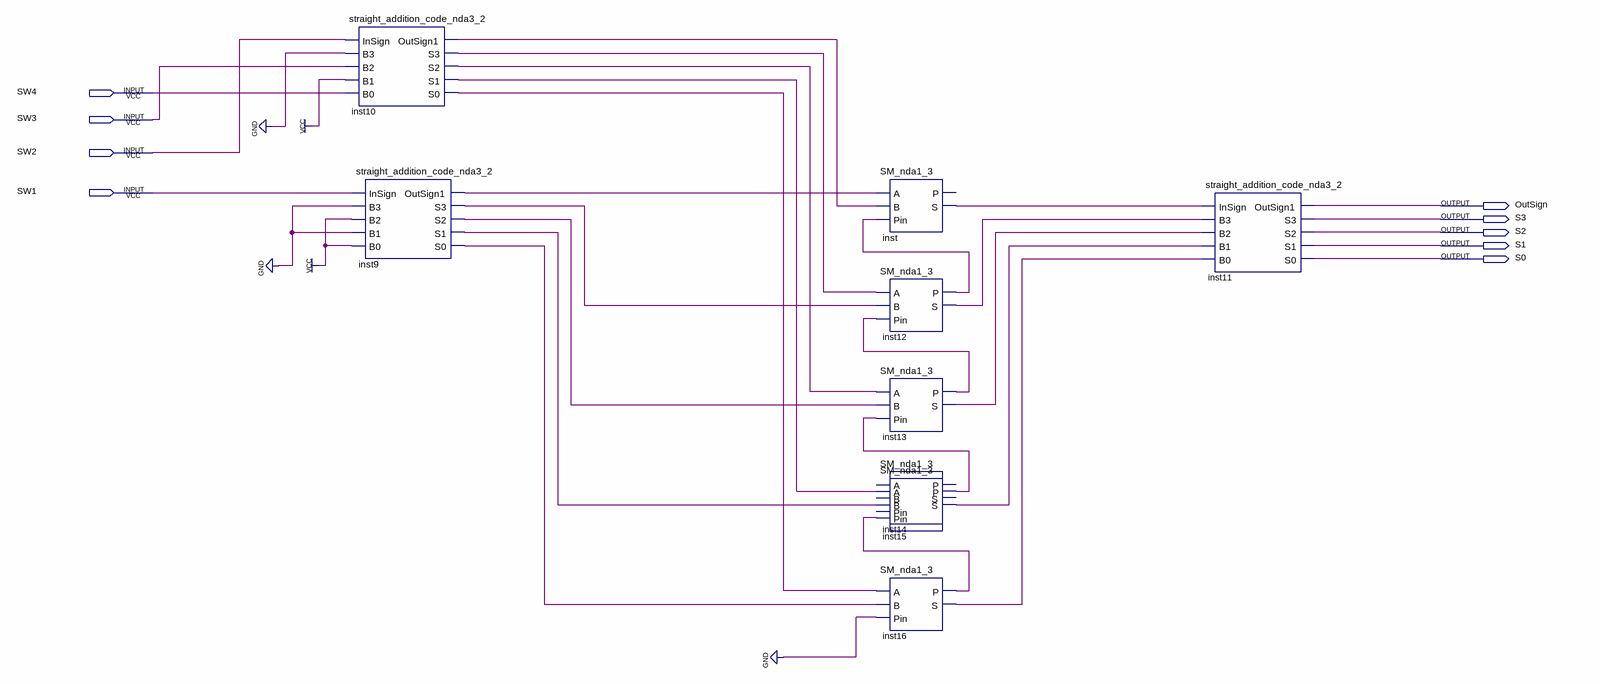
[diagram p0: schematic sheet]
// Quartus schematic ALU_nda1_3.bdf as structural Verilog: 9 symbols, 9 pins
module ALU_nda1_3 (
  input  SW4,
  input  SW3,
  input  SW2,
  input  SW1,
  output OutSign,
  output S3,
  output S2,
  output S1,
  output S0
);

  wire inst9_outsign1, inst9_s0, inst9_s1, inst9_s2, inst9_s3, inst10_outsign1, inst10_s0, inst10_s1,
       inst10_s2, inst10_s3, inst12_p, inst12_s, inst13_p, inst13_s, inst15_p, inst15_s, inst16_p, inst16_s,
       inst_s;

  straight_addition_code_nda3_2 inst10 (
    .InSign(SW2), .B3(1'b0), .B2(SW3), .B1(1'b1), .B0(SW4), .OutSign1(inst10_outsign1), .S3(inst10_s3),
    .S2(inst10_s2), .S1(inst10_s1), .S0(inst10_s0));
  straight_addition_code_nda3_2 inst9 (
    .InSign(SW1), .B3(1'b0), .B2(1'b1), .B1(1'b0), .B0(1'b1), .OutSign1(inst9_outsign1), .S3(inst9_s3),
    .S2(inst9_s2), .S1(inst9_s1), .S0(inst9_s0));
  SM_nda1_3 inst (.A(inst9_outsign1), .B(inst10_outsign1), .Pin(inst12_p), .S(inst_s));  // open: P
  SM_nda1_3 inst12 (.A(inst10_s3), .B(inst9_s3), .Pin(inst13_p), .P(inst12_p), .S(inst12_s));
  SM_nda1_3 inst13 (.A(inst10_s2), .B(inst9_s2), .Pin(inst15_p), .P(inst13_p), .S(inst13_s));
  SM_nda1_3 inst14 ();  // open: A, B, Pin, P, S
  SM_nda1_3 inst15 (.A(inst10_s1), .B(inst9_s1), .Pin(inst16_p), .P(inst15_p), .S(inst15_s));
  SM_nda1_3 inst16 (.A(inst10_s0), .B(inst9_s0), .Pin(1'b0), .P(inst16_p), .S(inst16_s));
  straight_addition_code_nda3_2 inst11 (
    .InSign(inst_s), .B3(inst12_s), .B2(inst13_s), .B1(inst15_s), .B0(inst16_s), .OutSign1(OutSign), .S3(S3),
    .S2(S2), .S1(S1), .S0(S0));
endmodule
